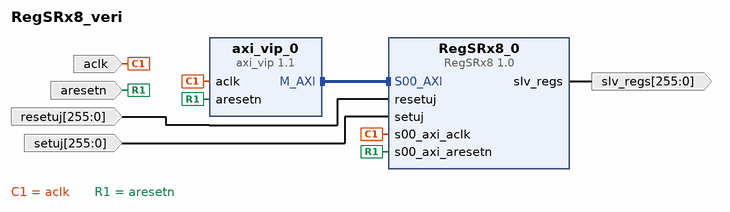
[diagram p0: block diagram of the top level]
# Vivado block design RegSRx8_veri, xczu9eg-ffvc900-1-e, Vivado 2025.1
create_bd_design RegSRx8_veri

create_bd_port -dir I aresetn
create_bd_port -dir I aclk
create_bd_port -dir I -from 255 -to 0 resetuj
create_bd_port -dir I -from 255 -to 0 setuj
create_bd_port -dir O -from 255 -to 0 slv_regs

create_bd_cell -type ip -vlnv xilinx.com:user:RegSRx8:1.0 RegSRx8_0
create_bd_cell -type ip -vlnv xilinx.com:ip:axi_vip:1.1 axi_vip_0
set_property -dict [list \
  CONFIG.ADDR_WIDTH 32 \
  CONFIG.DATA_WIDTH 32 \
  CONFIG.HAS_BRESP 1 \
  CONFIG.HAS_PROT 1 \
  CONFIG.HAS_RRESP 1 \
  CONFIG.HAS_WSTRB 1 \
  CONFIG.INTERFACE_MODE MASTER \
  CONFIG.PROTOCOL AXI4LITE \
  CONFIG.READ_WRITE_MODE READ_WRITE \
] [get_bd_cells axi_vip_0]

# ---- connections ----

connect_bd_intf_net [get_bd_intf_pins axi_vip_0/M_AXI] [get_bd_intf_pins RegSRx8_0/S00_AXI]
connect_bd_net [get_bd_ports aclk] [get_bd_pins RegSRx8_0/s00_axi_aclk] [get_bd_pins axi_vip_0/aclk]
connect_bd_net [get_bd_ports aresetn] [get_bd_pins RegSRx8_0/s00_axi_aresetn] [get_bd_pins axi_vip_0/aresetn]
connect_bd_net [get_bd_pins RegSRx8_0/slv_regs] [get_bd_ports slv_regs]
connect_bd_net [get_bd_ports resetuj] [get_bd_pins RegSRx8_0/resetuj]
connect_bd_net [get_bd_ports setuj] [get_bd_pins RegSRx8_0/setuj]

# ---- address map ----
assign_bd_address -offset 0x44A00000 -range 64K -target_address_space [get_bd_addr_spaces axi_vip_0/Master_AXI] [get_bd_addr_segs RegSRx8_0/S00_AXI/S00_AXI_reg]

validate_bd_design
save_bd_design
